# EAGLE design Granulobot_V10 (EAGLE 9.6.1)
DATE: 22-04-2019; REV: V1 P3; TITLE: TinyPICO
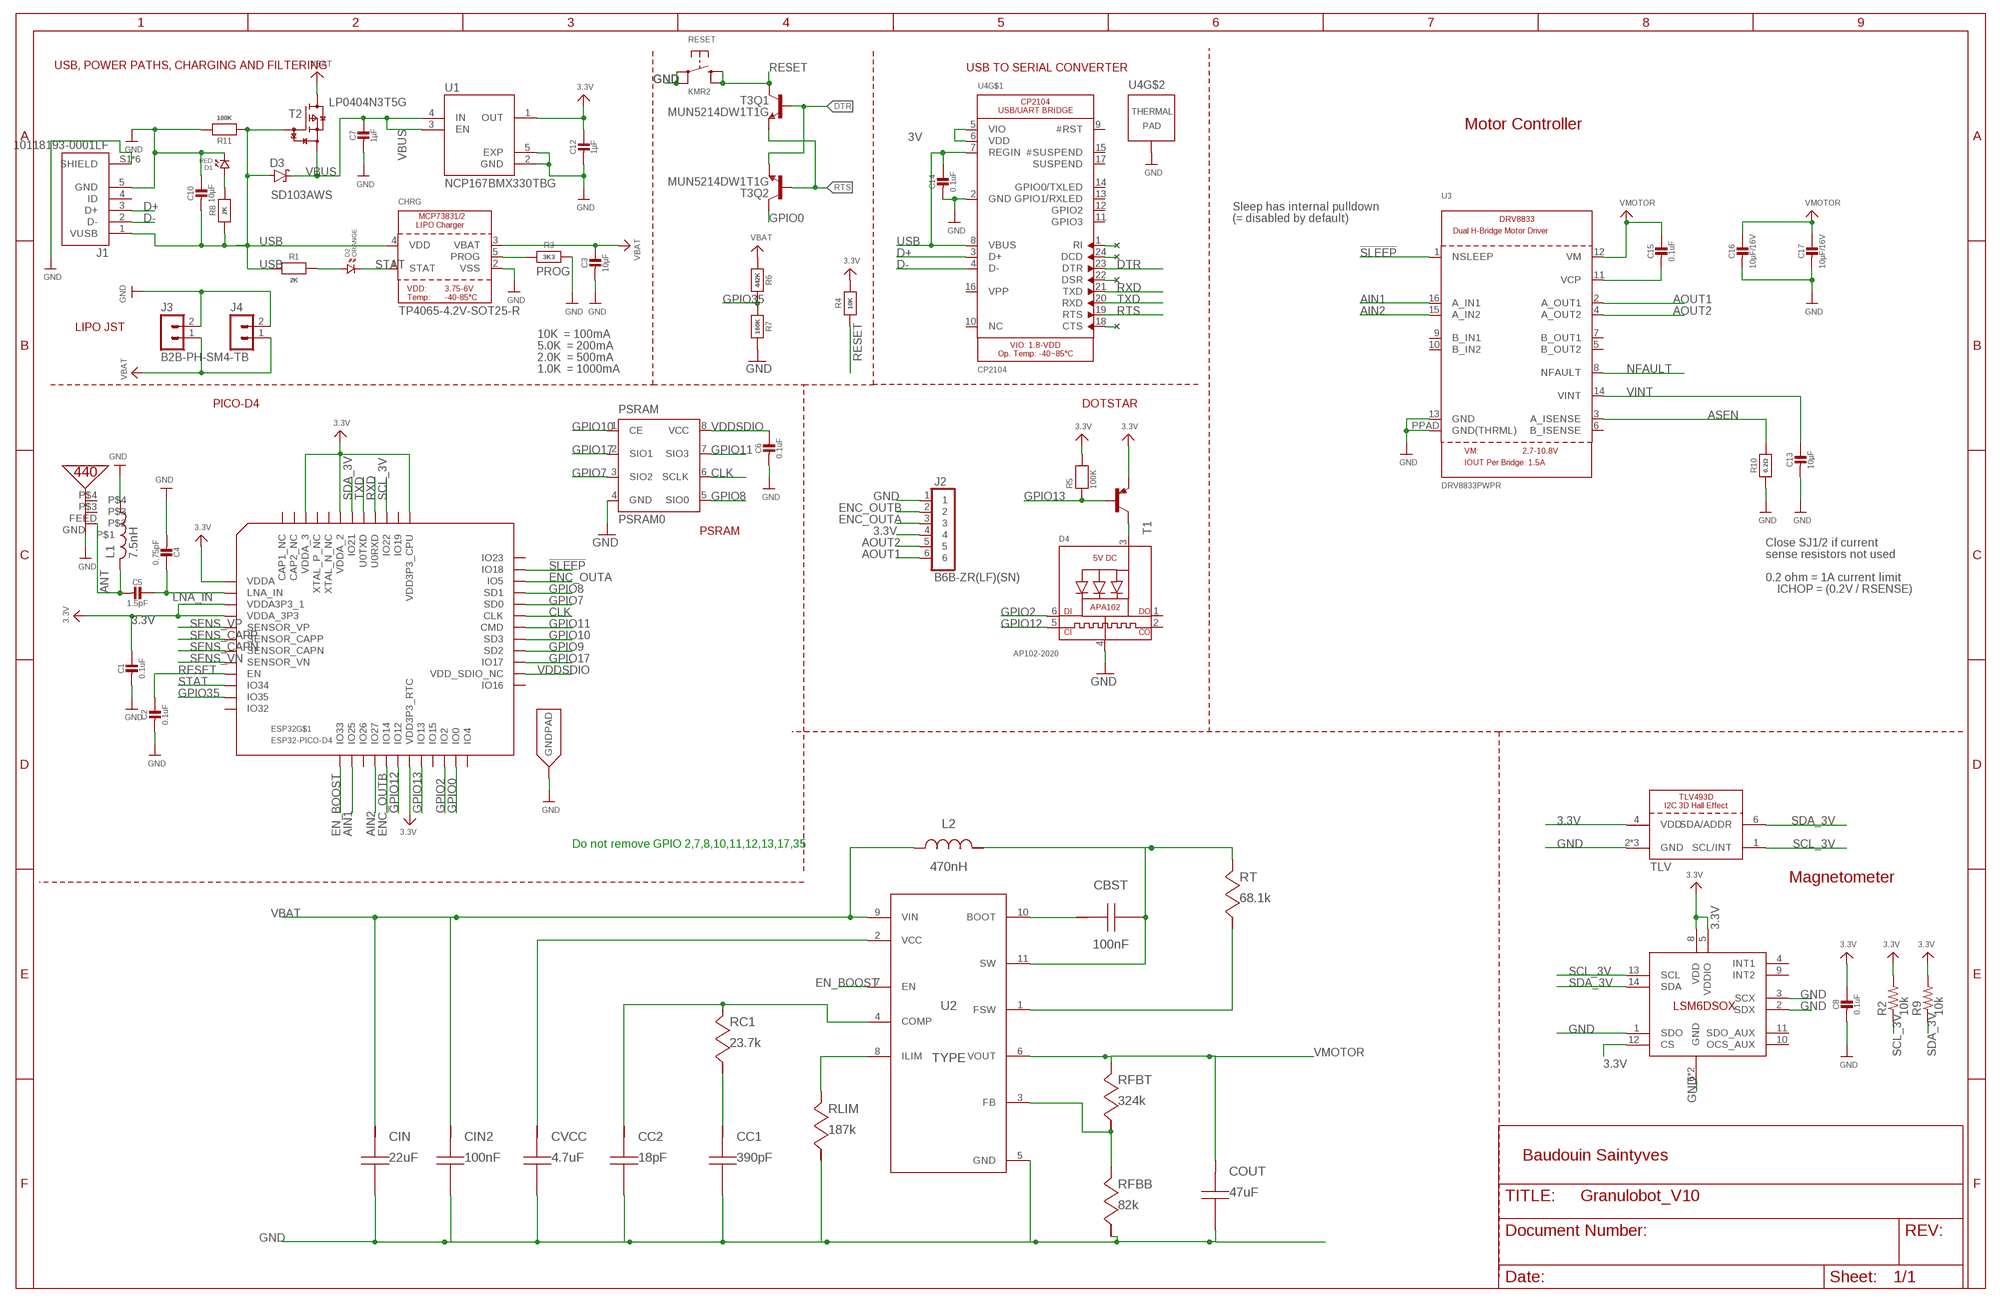
[diagram p0: schematic, sheet 1]

## Parts
ANT  PRO-OB-440  [PRO-OB-440]
C1  0.1uF  CAP_CERAMIC_0402MP  [_0402MP]
C2  0.1uF  CAP_CERAMIC_0402MP  [_0402MP]
C3  10µF  CAP_CERAMIC_0603MP  [_0603MP]
C4  0.75pF  CAP_CERAMIC_0402MP  [_0402MP]
C5  1.5pF  CAP_CERAMIC_0402MP  [_0402MP]
C6  0.1uF  CAP_CERAMIC_0402MP  [_0402MP]
C7  1µF  CAP_CERAMIC_0402MP  [_0402MP]
C8  0.1uF  CAP_CERAMIC0603_NO  [0603-NO]
C10  10µF  CAP_CERAMIC_0603MP  [_0603MP]
C12  1µF  CAP_CERAMIC_0402MP  [_0402MP]
C13  10µF  CAP_CERAMIC0805-NOOUTLINE  [0805-NO]
C14  0.1uF  CAP_CERAMIC_0402MP  [_0402MP]
C15  0.1uF  CAP_CERAMIC0805-NOOUTLINE  [0805-NO]
C16  10µF/16V  CAP_CERAMIC0805-NOOUTLINE  [0805-NO]
C17  10µF/16V  CAP_CERAMIC0805-NOOUTLINE  [0805-NO]
CBST  100nF  GRM155R71A104KA01D  [0402]
CC1  390pF  GRM1555C1H391JA01J  [0402]
CC2  18pF  C0402C0G1C180J020BC  [01005]
CHRG  TP4065-4.2V-SOT25-R  MCP73831/2  [SOT23-5]
CIN  22uF  GRM21BR61A226ME44L  [0805]
CIN2  100nF  GRM155R71C104KA88D  [0402]
COUT  47uF  C3216X5R1E476M160ACC3216X5R1E476M160AC  [1206]
CVCC  4.7uF  GRM155R61A475MEAAD  [0402_065]
D1  RED  LED.0402  [0402.LED]
D2  ORANGE  LED.0402  [0402.LED]
D3  BAT60J  [SOD323_ST]
D4  AP102-2020  MICROBUILDER_APA1022020  [MICROBUILDER_APA102_2020]
ESP32  ESP32-PICO-D4  [PICO-D4-QFN48]
J1  10118193-0001LF  [FCI_10118193-0001LF]
J2  B6B-ZR(LF)(SN)  [JST_B6B-ZR(LF)(SN)]
J3  B2B-PH-SM4-TB  [B2B-PH-SM4-TB]
J4  B2B-PH-SM4-TB  [B2B-PH-SM4-TB]
L1  7.5nH  INDUCTOR_0402_N  [RESC0402_N]
L2  470nH  IHLP1212AEERR47M11  [IHLP-1212AE]
LSM6  LSM6DSOX  [LGA-14L]
PSRAM  PSRAM0  [SOP8]
R1  2K  RESISTOR_0402MP  [_0402MP]
R2  10k  R-US_R0603  [R0603]
R3  3K3  RESISTOR_0402MP  [_0402MP]
R4  10K  RESISTOR_0402MP  [_0402MP]
R5  100K  RESISTOR_0402MP  [_0402MP]
R6  442K  RESISTOR_0402MP  [_0402MP]
R7  160K  RESISTOR_0402MP  [_0402MP]
R8  2K  RESISTOR_0402MP  [_0402MP]
R9  10k  R-US_R0603  [R0603]
R10  0.2Ω  RESISTOR_1206  [_1206]
R11  100K  RESISTOR_0402MP  [_0402MP]
RC1  23.7k  RC0201FR-0723K7L  [0201]
RESET  KMR2  SWITCH_TACT_SMT4.6X2.8  [BTN_KMR2_4.6X2.8]
RFBB  82k  RC0603FR-0782KL  [0603]
RFBT  324k  CRCW0402324KFKED  [0402]
RLIM  187k  CRCW0402187KFKED  [0402]
RT  68.1k  CRCW020168K1FKED  [0201]
T1  TINYPICO-PNPAMB  [SOT883(B)]
T2  TINYPICO-P-FETKMB  [SOT883(B)]
T3  MUN5214DW1T1G  MBT3904DW1T1  [DUAL_NPN_SC70-6]
TLV  TLV493D  [SOT23-6]
U1  NCP170AMX300TCG  [VREG_NCP170AMX300TCG]
U2  Value  TPS61089RNRR  [RNR0011A]
U3  DRV8833PWPR  DRV8833  [HTSSOP16]
U4  CP2104  MICROBUILDER_CP2104  [MICROBUILDER_QFN24_4MM_SMSC]

## Nets
3.3V: C1.1 C8.1 C12.1 ESP32.1(VDDA) ESP32.3(VDDA3P3_1) ESP32.4(VDDA_3P3) ESP32.19(VDD3P3_RTC) ESP32.37(VDD3P3_CPU) ESP32.43(VDDA_2) ESP32.46(VDDA_3) J2.4 LSM6.5(VDDIO) LSM6.8(VDD) LSM6.12(CS) R2.2 R4.2 R5.2 R9.2 T1.2(E) TLV.4(VDD) U1.1(OUT)
3V: U4.5(VIO) U4.6(VDD)
!SLEEP: ESP32.35(IO18) U3.1(NSLEEP)
AIN1: ESP32.14(IO25) U3.16(A_IN1)
AIN2: ESP32.16(IO27) U3.15(A_IN2)
ANT: ANT.FEED C5.2 L1.2
AOUT1: J2.6 U3.2(A_OUT1)
AOUT2: J2.5 U3.4(A_OUT2)
ASEN: R10.2 U3.3(A_ISENSE)
CLK: ESP32.31(CLK) PSRAM.6(SCLK)
D+: J1.3(D+) U4.3(D+)
D-: J1.2(D-) U4.4(D-)
DTR: T3.1(Q2:E) T3.5(Q1:B) U4.23(DTR)
EN_BOOST: ESP32.13(IO33) U2.7(EN)
ENC_OUTA: ESP32.34(IO5) J2.3
ENC_OUTB: ESP32.17(IO14) J2.2
GND: ANT.GND C1.2 C2.2 C3.2 C4.2 C6.2 C7.2 C8.2 C10.1 C12.2 C13.2 C14.2 C16.2 C17.2 CC1.2 CC2.2 CHRG.2(VSS) CIN2.2 CIN.2 COUT.2 CVCC.2 D1.P$2 D4.4(GND) ESP32.EXP(GNDPAD) J1.5(GND) J1.S1(SHIELD) J1.S2(SHIELD) J1.S3(SHIELD) J1.S4(SHIELD) J1.S5(SHIELD) J1.S6(SHIELD) J2.1 J3.2 J4.2 L1.1 LSM6.1(SDO) LSM6.2(SDX) LSM6.3(SCX) LSM6.6(GND) LSM6.7(GND) PSRAM.4(GND) R3.2 R7.2 R10.1 R11.2 RESET.A'(P1) RESET.A(P) RFBB.2 RLIM.2 TLV.2(GND) TLV.3(GND) TLV.5(GND) U1.2(GND) U1.5(EXP) U2.5(GND) U3.13(GND) U3.PPAD(GND(THRML)) U4.2(GND) U4.THERM(TP)
GPIO0: ESP32.23(IO0) T3.6(Q2:C)
GPIO2: D4.6(DI) ESP32.22(IO2)
GPIO7: ESP32.32(SD0) PSRAM.3(SIO2)
GPIO8: ESP32.33(SD1) PSRAM.5(SIO0)
GPIO9: ESP32.28(SD2)
GPIO10: ESP32.29(SD3) PSRAM.1(CE)
GPIO11: ESP32.30(CMD) PSRAM.7(SIO3)
GPIO12: D4.5(CKI) ESP32.18(IO12)
GPIO13: ESP32.20(IO13) R5.1 T1.1(B)
GPIO17: ESP32.27(IO17) PSRAM.2(SIO1)
GPIO35: ESP32.11(IO35) R6.2 R7.1
LNA_IN: C4.1 C5.1 ESP32.2(LNA_IN)
N$1: D1.P$1 R8.2
N$2: D2.P$1 R1.2
N$4: U4.1(RI)
N$5: U4.24(DCD)
N$6: U4.22(DSR)
N$7: U4.18(CTS)
N$8: D4.3(VDD) T1.3(C)
N$9: C15.2 U3.11(VCP)
N$10: RFBB.1 RFBT.2 U2.3(FB)
N$13: RLIM.1 U2.8(ILIM)
N$14: CBST.1 U2.10(BOOT)
N$15: CBST.2 L2.2 RT.1 U2.11(SW)
N$17: CVCC.1 U2.2(VCC)
N$18: CC1.1 RC1.2
N$19: CC2.1 RC1.1 U2.4(COMP)
N$20: RT.2 U2.1(FSW)
NFAULT: U3.8(NFAULT)
PROG: CHRG.5(PROG) R3.1
RESET: C2.1 ESP32.9(EN) R4.1 RESET.B'(S1) RESET.B(S) T3.3(Q1:C)
RTS: T3.2(Q2:B) T3.4(Q1:E) U4.19(RTS)
RXD: ESP32.40(U0RXD) U4.21(TXD)
SCL_3V: ESP32.39(IO22) LSM6.13(SCL) R2.1 TLV.1(SCL/INT)
SDA_3V: ESP32.42(IO21) LSM6.14(SDA) R9.1 TLV.6(SDA/ADDR)
SENS_CAPN: ESP32.7(SENSOR_CAPN)
SENS_CAPP: ESP32.6(SENSOR_CAPP)
SENS_VN: ESP32.8(SENSOR_VN)
SENS_VP: ESP32.5(SENSOR_VP)
STAT: CHRG.1(STAT) D2.P$2 ESP32.10(IO34)
TXD: ESP32.41(U0TXD) U4.20(RXD)
USB: C10.2 C14.1 CHRG.4(VDD) D3.A J1.1(VUSB) R1.1 R8.1 R11.1 T2.1(G) U4.7(REGIN) U4.8(VBUS)
VBAT: C3.1 CHRG.3(VBAT) CIN2.1 CIN.1 J3.1 J4.1 L2.1 R6.1 T2.3(D) U2.9(VIN)
VBUS: C7.1 D3.C T2.2(S) U1.3(EN) U1.4(IN)
VDDSDIO: C6.1 ESP32.26(VDD_SDIO_NC) PSRAM.8(VCC)
VINT: C13.1 U3.14(VINT)
VMOTOR: C15.1 C16.1 C17.1 COUT.1 RFBT.1 U2.6(VOUT) U3.12(VM)
Unconnected: ANT.P$3 ANT.P$4 D4.1(DO) D4.2(CKO) ESP32.12(IO32) ESP32.15(IO26) ESP32.21(IO15) ESP32.24(IO4) ESP32.25(IO16) ESP32.36(IO23) ESP32.38(IO19) ESP32.44(XTAL_N_NC) ESP32.45(XTAL_P_NC) ESP32.47(CAP2_NC) ESP32.48(CAP1_NC) J1.4(ID) LSM6.4(INT1) LSM6.9(INT2) LSM6.10(OCS_AUX) LSM6.11(SDO_AUX) U3.5(B_OUT2) U3.6(B_ISENSE) U3.7(B_OUT1) U3.9(B_IN1) U3.10(B_IN2) U4.9(#RST) U4.10(NC) U4.11(GPIO3) U4.12(GPIO2) U4.13(GPIO1/RXLED) U4.14(GPIO0/TXLED) U4.15(#SUSPEND) U4.16(VPP) U4.17(SUSPEND)

## Notes on the sheet
- USB, POWER PATHS, CHARGING AND FILTERING | USB TO SERIAL CONVERTER
- LP0404N3T5G
- Motor Controller
- NCP167BMX330TBG
- SD103AWS
- Sleep has internal pulldown
- (= disabled by default)
- LIPO JST
- 10K  = 100mA
- 5.0K  = 200mA
- 2.0K  = 500mA
- 1.0K  = 1000mA
- PICO-D4 | DOTSTAR
- PSRAM
- Close SJ1/2 if current
- sense resistors not used
- 0.2 ohm = 1A current limit
- ICHOP = (0.2V / RSENSE)
- Do not remove GPIO 2,7,8,10,11,12,13,17,35
- Magnetometer
- Baudouin Saintyves

## Library data of the parts
ANT = UnexpectedMaker:PRO-OB-440; OC_NEWARK: unknown
C1 C2 C6 C14 = microbuilder:CAP_CERAMIC: Ceramic Capacitors For new designs, use the packages preceded by an '_' character since they are more reliable: The following footprints should be used on most boards: _0402 - Standard footprint for regular board layouts _0603 - Standard footprint for regular board layouts _0805 - Standard footprint for regular board layouts _1206 - Standard footprint for regular board layouts For extremely tight-pitch boards where space is at a premium, the following 'micro-pitch' footprints can be used (smaller pads, no silkscreen outline, etc.): _0402MP - Micro-pitch footprint for very dense/compact boards _0603MP - Micro-pitch footprint for very dense/compact boards _0805MP - Micro-pitch footprint for very dense/compact boards _1206MP - Micro-pitch footprint for very dense/compact boards; MF: MULTICOMP PRO; MPN: MC0402X104K250CT; OC_NEWARK: 06X6159
C3 C10 = microbuilder:CAP_CERAMIC: Ceramic Capacitors For new designs, use the packages preceded by an '_' character since they are more reliable: The following footprints should be used on most boards: _0402 - Standard footprint for regular board layouts _0603 - Standard footprint for regular board layouts _0805 - Standard footprint for regular board layouts _1206 - Standard footprint for regular board layouts For extremely tight-pitch boards where space is at a premium, the following 'micro-pitch' footprints can be used (smaller pads, no silkscreen outline, etc.): _0402MP - Micro-pitch footprint for very dense/compact boards _0603MP - Micro-pitch footprint for very dense/compact boards _0805MP - Micro-pitch footprint for very dense/compact boards _1206MP - Micro-pitch footprint for very dense/compact boards; MF: SAMSUNG ELECTRO-MECHANICS; MPN: CL10A106KP8NNNC; OC_NEWARK: 82AC9284
C4 = microbuilder:CAP_CERAMIC: Ceramic Capacitors For new designs, use the packages preceded by an '_' character since they are more reliable: The following footprints should be used on most boards: _0402 - Standard footprint for regular board layouts _0603 - Standard footprint for regular board layouts _0805 - Standard footprint for regular board layouts _1206 - Standard footprint for regular board layouts For extremely tight-pitch boards where space is at a premium, the following 'micro-pitch' footprints can be used (smaller pads, no silkscreen outline, etc.): _0402MP - Micro-pitch footprint for very dense/compact boards _0603MP - Micro-pitch footprint for very dense/compact boards _0805MP - Micro-pitch footprint for very dense/compact boards _1206MP - Micro-pitch footprint for very dense/compact boards; MF: MURATA; MPN: GJM1555C1HR75BB01D; OC_NEWARK: 66AH5898
C5 = microbuilder:CAP_CERAMIC: Ceramic Capacitors For new designs, use the packages preceded by an '_' character since they are more reliable: The following footprints should be used on most boards: _0402 - Standard footprint for regular board layouts _0603 - Standard footprint for regular board layouts _0805 - Standard footprint for regular board layouts _1206 - Standard footprint for regular board layouts For extremely tight-pitch boards where space is at a premium, the following 'micro-pitch' footprints can be used (smaller pads, no silkscreen outline, etc.): _0402MP - Micro-pitch footprint for very dense/compact boards _0603MP - Micro-pitch footprint for very dense/compact boards _0805MP - Micro-pitch footprint for very dense/compact boards _1206MP - Micro-pitch footprint for very dense/compact boards; MF: TDK; MPN: C1005C0G1H1R5B050BA; OC_NEWARK: 90R7557
C7 C12 = microbuilder:CAP_CERAMIC: Ceramic Capacitors For new designs, use the packages preceded by an '_' character since they are more reliable: The following footprints should be used on most boards: _0402 - Standard footprint for regular board layouts _0603 - Standard footprint for regular board layouts _0805 - Standard footprint for regular board layouts _1206 - Standard footprint for regular board layouts For extremely tight-pitch boards where space is at a premium, the following 'micro-pitch' footprints can be used (smaller pads, no silkscreen outline, etc.): _0402MP - Micro-pitch footprint for very dense/compact boards _0603MP - Micro-pitch footprint for very dense/compact boards _0805MP - Micro-pitch footprint for very dense/compact boards _1206MP - Micro-pitch footprint for very dense/compact boards; MF: MURATA; MPN: GRT155R70J105KE01D.; OC_NEWARK: 01AC8891
C8 = microbuilder:CAP_CERAMIC: Ceramic Capacitors For new designs, use the packages preceded by an '_' character since they are more reliable: The following footprints should be used on most boards: _0402 - Standard footprint for regular board layouts _0603 - Standard footprint for regular board layouts _0805 - Standard footprint for regular board layouts _1206 - Standard footprint for regular board layouts For extremely tight-pitch boards where space is at a premium, the following 'micro-pitch' footprints can be used (smaller pads, no silkscreen outline, etc.): _0402MP - Micro-pitch footprint for very dense/compact boards _0603MP - Micro-pitch footprint for very dense/compact boards _0805MP - Micro-pitch footprint for very dense/compact boards _1206MP - Micro-pitch footprint for very dense/compact boards; MF: MULTICOMP PRO; MPN: MCSH18B104K250CT; OC_NEWARK: 23T7348
C13 = microbuilder:CAP_CERAMIC: Ceramic Capacitors For new designs, use the packages preceded by an '_' character since they are more reliable: The following footprints should be used on most boards: _0402 - Standard footprint for regular board layouts _0603 - Standard footprint for regular board layouts _0805 - Standard footprint for regular board layouts _1206 - Standard footprint for regular board layouts For extremely tight-pitch boards where space is at a premium, the following 'micro-pitch' footprints can be used (smaller pads, no silkscreen outline, etc.): _0402MP - Micro-pitch footprint for very dense/compact boards _0603MP - Micro-pitch footprint for very dense/compact boards _0805MP - Micro-pitch footprint for very dense/compact boards _1206MP - Micro-pitch footprint for very dense/compact boards; MF: TAIYO YUDEN; MPN: LMK212BJ106KG-T; OC_NEWARK: 18J2720
C15 = microbuilder:CAP_CERAMIC: Ceramic Capacitors For new designs, use the packages preceded by an '_' character since they are more reliable: The following footprints should be used on most boards: _0402 - Standard footprint for regular board layouts _0603 - Standard footprint for regular board layouts _0805 - Standard footprint for regular board layouts _1206 - Standard footprint for regular board layouts For extremely tight-pitch boards where space is at a premium, the following 'micro-pitch' footprints can be used (smaller pads, no silkscreen outline, etc.): _0402MP - Micro-pitch footprint for very dense/compact boards _0603MP - Micro-pitch footprint for very dense/compact boards _0805MP - Micro-pitch footprint for very dense/compact boards _1206MP - Micro-pitch footprint for very dense/compact boards; MF: MULTICOMP PRO; MPN: MCSH21B104K100CT; OC_NEWARK: 23T7403
C16 C17 = microbuilder:CAP_CERAMIC: Ceramic Capacitors For new designs, use the packages preceded by an '_' character since they are more reliable: The following footprints should be used on most boards: _0402 - Standard footprint for regular board layouts _0603 - Standard footprint for regular board layouts _0805 - Standard footprint for regular board layouts _1206 - Standard footprint for regular board layouts For extremely tight-pitch boards where space is at a premium, the following 'micro-pitch' footprints can be used (smaller pads, no silkscreen outline, etc.): _0402MP - Micro-pitch footprint for very dense/compact boards _0603MP - Micro-pitch footprint for very dense/compact boards _0805MP - Micro-pitch footprint for very dense/compact boards _1206MP - Micro-pitch footprint for very dense/compact boards; MF: YAGEO; MPN: CC0805KKX5R8BB106; OC_NEWARK: 69AH7309
CBST = accelerated_DesignTPS61089:GRM155R71A104KA01D; CAP: 1.0E7; ESR: 0.0; IRMS: 0.0; MANUFACTURER_NAME: MuRata; MANUFACTURER_PART_NUMBER: GRM155R71A104KA01D; MF: MULTICOMP PRO; MPN: MC0402X104K250CT; OC_NEWARK: 06X6159; VDC: 10.0; VENDOR: MuRata
CC1 = accelerated_DesignTPS61089:GRM1555C1H391JA01J; CAP: 3.9E10; DATASHEETURL: httpwww.murata.comproductscatalogpdfc02e.pdf; ESR: 0.0; IRMS: 0.0; MANUFACTURER_NAME: MuRata; MANUFACTURER_PART_NUMBER: GRM1555C1H391JA01J; MF: MULTICOMP PRO; MPN: MC0402B391K250CT; OC_NEWARK: 33R0285; VDC: 50.0; VENDOR: MuRata
CC2 = accelerated_DesignTPS61089:C0402C0G1C180J020BC; CAP: 1.8E11; DATASHEETURL: httpproduct.tdk.comcapacitormlccendocumentsmlcc%5Fcommercial%5Fgeneral%5Fen.pdf; ESR: 0.0; IRMS: 0.0; MANUFACTURER_NAME: TDK; MANUFACTURER_PART_NUMBER: C0402C0G1C180J020BC; MF: MURATA; MPN: GRM0225C1E180GA02L; OC_NEWARK: 66AH5990; VDC: 16.0; VENDOR: TDK
CHRG = microbuilder:MCP73831/2: MCP73831/2 LIPO Charger VDD: 3.75 - 6V Temp -40 - 85°C Programmable Charge Rate: 15-500mA NOTE: STAT is a tri-state logic output on the MCP73831 and an open-drain output on the MCP73832. SOT23-5 with 4.2V output and tri-state logic on STAT = MCP73831T-2ACI/OT; OC_NEWARK: unknown
CIN = accelerated_DesignTPS61089:GRM21BR61A226ME44L; CAP: 2.2E5; DATASHEETURL: httpssearch.murata.co.jpCeramyimageimgA01XG101ENGGRM21BR61A226ME44%2D01.pdf; ESR: 0.003; IRMS: 3.84; MANUFACTURER_NAME: MuRata; MANUFACTURER_PART_NUMBER: GRM21BR61A226ME44L; MF: KEMET; MPN: C1210C224J3GACTU; OC_NEWARK: 50AC8493; VDC: 10.0; VENDOR: MuRata
CIN2 = accelerated_DesignTPS61089:GRM155R71C104KA88D; CAP: 1.0E7; ESR: 0.0; IRMS: 0.0; MANUFACTURER_NAME: MuRata; MANUFACTURER_PART_NUMBER: GRM155R71C104KA88D; MF: MULTICOMP PRO; MPN: MC0402X104K250CT; OC_NEWARK: 06X6159; VDC: 16.0; VENDOR: MuRata
COUT = AcceleratedDesigns_Lib:C3216X5R1E476M160AC; CAP_F: 0.000047; MANUFACTURER_NAME: TDK; MANUFACTURER_PART_NUMBER: C3216X5R1E476M160AC; MF: KEMET; MOUNTTYPE: SMT; MPN: C0603C474K4PACTU; OC_NEWARK: 07X0824; ROHS: Y; VDC_V: 25
CVCC = accelerated_DesignTPS61089:GRM155R61A475MEAAD; CAP: 4.7E6; DATASHEETURL: httpsearch.murata.co.jpCeramyimageimgA01XG101ENGGRM155R61A475MEAA%2D01.pdf; ESR: 0.001; IRMS: 0.0; MANUFACTURER_NAME: MuRata; MANUFACTURER_PART_NUMBER: GRM155R61A475MEAAD; MF: TAIYO YUDEN; MPN: JMK105BBJ475MV-F; OC_NEWARK: 29T3551; VDC: 10.0; VENDOR: MuRata
D1 = cmonr_standardparts:LED; MF: WURTH ELEKTRONIK; MPN: 150040SS73220; OC_NEWARK: 95AC2581
D2 = cmonr_standardparts:LED; MF: DIALIGHT; MPN: 5988A30107F; OC_NEWARK: 07AH7391
D3 = diode:BAT60J: Schottky barrier diode Source: www.st.com, BAT60J.pdf; MF: STMICROELECTRONICS; MPN: BAT60JFILM; OC_NEWARK: 58M3986
D4 = UnexpectedMaker:MICROBUILDER_APA102: APA102/DotStar Pixels VCC: 5V DC Refresh Rate: 400Hz; OC_NEWARK: unknown
ESP32 = UnexpectedMaker:ESP32-PICO-D4; OC_NEWARK: unknown
J1 = microUSB_10118193-0001LF:10118193-0001LF: Micro USB B Type Receptacle; DESCRIPTION: USB - micro B USB 2.0 Receptacle Connector 5 Position Surface Mount, Right Angle; Through Hole; DIGI-KEY_PART_NUMBER: 609-4616-1-ND; MF: FCI; MP: 10118193-0001LF; PACKAGE: None; PURCHASE-URL: https://pricing.snapeda.com/search/part/10118193-0001LF/?ref=eda
J2 = B6B-ZR_LF__SN_:B6B-ZR(LF)(SN): ZR Series 1.5 mm Pitch 6 Position Through Hole Top Entry Shrouded Heade Check prices <https://pricing.snapeda.com/parts/B6B-ZR%28LF%29%28SN%29/JST%20Sales/view-part?ref=eda>; AVAILABILITY: Warning; DESCRIPTION: Connector Header Through Hole 6 position 0.059 (1.50mm); MF: JST Sales; MP: B6B-ZR(LF)(SN); PACKAGE: None; PRICE: None; PURCHASE-URL: https://pricing.snapeda.com/search/part/B6B-ZR(LF)(SN)/?ref=eda
J3 J4 = con-JST PH:B2B-PH: JST PH series header 2.00mm pitch disconnectable crimp style connectors, vertical (side entry type), 2 pins; MF: JST (JAPAN SOLDERLESS TERMINALS); MPN: B2B-PH-SM4-TB(LF)(SN); OC_NEWARK: 37K9941
L1 = Nordic_nRF:INDUCTOR: Generic chip inductor; MF: PANASONIC; MPN: ELJ-QF7N5JF; OC_NEWARK: 99W1858
L2 = accelerated_DesignTPS61089:IHLP1212AEERR47M11; DATASHEETURL: httpwww.vishay.comdocs34300lp12ae11.pdf; DCR: 15.0; DESCRIPTION: Unknown; IDC: 6.7; L: 4.7E7; MANUFACTURER: Vishay; MANUFACTURER_NAME: VishayDale; MANUFACTURER_PART_NUMBER: IHLP1212AEERR47M11; MF: VISHAY; MPN: IHLP1212AEERR47M11; OC_NEWARK: 27T2304; PACKAGE_DESIGNATOR: IHLP1212AE; VENDOR: VishayDale
LSM6 = microbuilder:LSM6DSOX; OC_NEWARK: unknown
PSRAM = UnexpectedMaker:PSRAM: H-bridge driver for brush motors Source: http://www.rohm.com/products/databook/motor/pdf/bd623x_series-e.pdf; MF: ROHM; MPN: BD6230F-E2; OC_FARNELL: 1716264; OC_NEWARK: 15R0529
R1 R8 = microbuilder:RESISTOR: Resistors For new designs, use the packages preceded by an '_' character since they are more reliable: The following footprints should be used on most boards: _0402 - Standard footprint for regular board layouts _0603 - Standard footprint for regular board layouts _0805 - Standard footprint for regular board layouts _1206 - Standard footprint for regular board layouts For extremely tight-pitch boards where space is at a premium, the following 'micro-pitch' footprints can be used (smaller pads, no silkscreen outline, etc.): _0402MP - Micro-pitch footprint for very dense/compact boards _0603MP - Micro-pitch footprint for very dense/compact boards _0805MP - Micro-pitch footprint for very dense/compact boards _1206MP - Micro-pitch footprint for very dense/compact boards; MF: PANASONIC; MPN: ERJ-2RKF2001X; OC_NEWARK: 73T6486
R2 R9 = adafruit:R-US_: RESISTOR, American symbol; MF: NIC COMPONENTS; MPN: NRC-AS06F1002TRF; OC_NEWARK: 52AH2942
R3 = microbuilder:RESISTOR: Resistors For new designs, use the packages preceded by an '_' character since they are more reliable: The following footprints should be used on most boards: _0402 - Standard footprint for regular board layouts _0603 - Standard footprint for regular board layouts _0805 - Standard footprint for regular board layouts _1206 - Standard footprint for regular board layouts For extremely tight-pitch boards where space is at a premium, the following 'micro-pitch' footprints can be used (smaller pads, no silkscreen outline, etc.): _0402MP - Micro-pitch footprint for very dense/compact boards _0603MP - Micro-pitch footprint for very dense/compact boards _0805MP - Micro-pitch footprint for very dense/compact boards _1206MP - Micro-pitch footprint for very dense/compact boards; MF: PANASONIC; MPN: ERJ-2RKF3301X; OC_NEWARK: 64R5278
R4 = microbuilder:RESISTOR: Resistors For new designs, use the packages preceded by an '_' character since they are more reliable: The following footprints should be used on most boards: _0402 - Standard footprint for regular board layouts _0603 - Standard footprint for regular board layouts _0805 - Standard footprint for regular board layouts _1206 - Standard footprint for regular board layouts For extremely tight-pitch boards where space is at a premium, the following 'micro-pitch' footprints can be used (smaller pads, no silkscreen outline, etc.): _0402MP - Micro-pitch footprint for very dense/compact boards _0603MP - Micro-pitch footprint for very dense/compact boards _0805MP - Micro-pitch footprint for very dense/compact boards _1206MP - Micro-pitch footprint for very dense/compact boards; MF: PANASONIC; MPN: ERJ-2RKF1002X; OC_NEWARK: 64R5248
R5 R11 = microbuilder:RESISTOR: Resistors For new designs, use the packages preceded by an '_' character since they are more reliable: The following footprints should be used on most boards: _0402 - Standard footprint for regular board layouts _0603 - Standard footprint for regular board layouts _0805 - Standard footprint for regular board layouts _1206 - Standard footprint for regular board layouts For extremely tight-pitch boards where space is at a premium, the following 'micro-pitch' footprints can be used (smaller pads, no silkscreen outline, etc.): _0402MP - Micro-pitch footprint for very dense/compact boards _0603MP - Micro-pitch footprint for very dense/compact boards _0805MP - Micro-pitch footprint for very dense/compact boards _1206MP - Micro-pitch footprint for very dense/compact boards; MF: MULTICOMP PRO; MPN: MCWR04X1003FTL; OC_NEWARK: 94X1105
R6 = microbuilder:RESISTOR: Resistors For new designs, use the packages preceded by an '_' character since they are more reliable: The following footprints should be used on most boards: _0402 - Standard footprint for regular board layouts _0603 - Standard footprint for regular board layouts _0805 - Standard footprint for regular board layouts _1206 - Standard footprint for regular board layouts For extremely tight-pitch boards where space is at a premium, the following 'micro-pitch' footprints can be used (smaller pads, no silkscreen outline, etc.): _0402MP - Micro-pitch footprint for very dense/compact boards _0603MP - Micro-pitch footprint for very dense/compact boards _0805MP - Micro-pitch footprint for very dense/compact boards _1206MP - Micro-pitch footprint for very dense/compact boards; MF: PANASONIC; MPN: ERJ-2RKF4423X; OC_NEWARK: 90W3049
R7 = microbuilder:RESISTOR: Resistors For new designs, use the packages preceded by an '_' character since they are more reliable: The following footprints should be used on most boards: _0402 - Standard footprint for regular board layouts _0603 - Standard footprint for regular board layouts _0805 - Standard footprint for regular board layouts _1206 - Standard footprint for regular board layouts For extremely tight-pitch boards where space is at a premium, the following 'micro-pitch' footprints can be used (smaller pads, no silkscreen outline, etc.): _0402MP - Micro-pitch footprint for very dense/compact boards _0603MP - Micro-pitch footprint for very dense/compact boards _0805MP - Micro-pitch footprint for very dense/compact boards _1206MP - Micro-pitch footprint for very dense/compact boards; MF: VISHAY; MPN: CRCW0402160KFKED; OC_NEWARK: 89M6611
R10 = microbuilder:RESISTOR: Resistors For new designs, use the packages preceded by an '_' character since they are more reliable: The following footprints should be used on most boards: _0402 - Standard footprint for regular board layouts _0603 - Standard footprint for regular board layouts _0805 - Standard footprint for regular board layouts _1206 - Standard footprint for regular board layouts For extremely tight-pitch boards where space is at a premium, the following 'micro-pitch' footprints can be used (smaller pads, no silkscreen outline, etc.): _0402MP - Micro-pitch footprint for very dense/compact boards _0603MP - Micro-pitch footprint for very dense/compact boards _0805MP - Micro-pitch footprint for very dense/compact boards _1206MP - Micro-pitch footprint for very dense/compact boards; MF: OHMITE; MPN: KDV12FR200ET; OC_NEWARK: 29AH2849
RC1 = accelerated_DesignTPS61089:RC0201FR-0723K7L; DATASHEETURL: httpwww.yageo.comdocumentsrecentPYu%2DRC%5FGroup%5F51%5FRoHS%5FL%5F5.pdf; MANUFACTURER_NAME: Yageo; MANUFACTURER_PART_NUMBER: RC0201FR0723K7L; OC_NEWARK: unknown; POWER: 0.05; RESISTANCE: 23700.0; TOLERANCE: 1.0; VENDOR: Yageo America
RESET = microbuilder:SWITCH_TACT_SMT: SMT Tact Switches 6x6mm - Digikey: P12940SCT-ND KMR2 (4.6x2.8mm) - Digikey: 401-1426-1-ND EVQ-PQHB55 - Light Touch, 160GF (4.5x4.5mm) - Digikey: P8090SCT-ND KMT0 - KMT021 NGJ LHS (etc.) IP68/Waterproof - Digikey: CKN10289CT-ND; MF: C & K COMPONENTS; MPN: KMR231G LFS; OC_NEWARK: 58M7853
RFBB = accelerated_DesignTPS61089:RC0603FR-0782KL; MANUFACTURER_NAME: Yageo; MANUFACTURER_PART_NUMBER: RC0603FR0782KL; MF: NIC COMPONENTS; MPN: NRC-AS06F8202TRF; OC_NEWARK: 52AH3034; POWER: 0.1; RESISTANCE: 82000.0; TOLERANCE: 1.0; VENDOR: Yageo America
RFBT = accelerated_DesignTPS61089:CRCW0402324KFKED; MANUFACTURER_NAME: VishayDale; MANUFACTURER_PART_NUMBER: CRCW0402324KFKED; MF: PANASONIC; MPN: ERJ-2RKF3243X; OC_NEWARK: 51W9080; POWER: 0.063; RESISTANCE: 324000.0; TOLERANCE: 1.0; VENDOR: VishayDale
RLIM = accelerated_DesignTPS61089:CRCW0402187KFKED; MANUFACTURER_NAME: VishayDale; MANUFACTURER_PART_NUMBER: CRCW0402187KFKED; MF: PANASONIC; MPN: ERJ-2RKF1873X; OC_NEWARK: 53W4257; POWER: 0.063; RESISTANCE: 187000.0; TOLERANCE: 1.0; VENDOR: VishayDale
RT = accelerated_DesignTPS61089:CRCW020168K1FKED; DATASHEETURL: httpwww.vishay.comdocs20052crcw0201e3.pdf; MANUFACTURER_NAME: VishayDale; MANUFACTURER_PART_NUMBER: CRCW020168K1FKED; MF: YAGEO; MPN: RC0201FR-0768K1L; OC_NEWARK: 82AH7827; POWER: 0.05; RESISTANCE: 68100.0; TOLERANCE: 1.0; VENDOR: VishayDale
T1 = UnexpectedMaker:TINYPICO-PNP: PNP general purpose transistors AAL Eindhoven MK; OC_NEWARK: unknown
T2 = UnexpectedMaker:TINYPICO-P-FET: 50 V, 150 mA P-channel Trench MOSFET P-channel enhancement mode Field-Effect Transistor (FET) in a small Surface-Mounted Device (SMD) plastic package using Trench MOSFET technology. AAL Eindhoven MK; OC_NEWARK: unknown
T3 = UnexpectedMaker:MBT3904DW1T1: MBT3904DW1 Dual NPN Transistors The MBT3904W1 puts two general purpose 3904 NPN transistors in a single package. Datasheet <http://www.onsemi.com/pub_link/Collateral/MBT3904DW1T1-D.PDF>; MF: ON SEMICONDUCTOR; MPN: MUN5214DW1T1G; OC_NEWARK: 10N9540; PROD_ID: TRANS-13337
TLV = microbuilder:TLV493D; MF: INFINEON; MPN: TLV493DA1B6HTSA2; OC_NEWARK: 18AC0661
U1 = NCP170AMX300TCG:NCP170AMX300TCG: Fixed LDO Voltage Regulator, 2.2V to 5.5V, 190mV Dropout, 3Vout, 150mAout, XDFN-4; AVAILABILITY: Unavailable; DESCRIPTION: Fixed LDO Voltage Regulator, 2.2V to 5.5V, 190mV Dropout, 3Vout, 150mAout, XDFN-4; MF: ON Semiconductor; MP: NCP170AMX300TCG; MPN: NCP170AMX300TCG; OC_NEWARK: 40Y8325; PACKAGE: XDFN-4 ON Semiconductor; PRICE: None
U2 = accelerated_DesignTPS61089:TPS61089RNRR; MANUFACTURER: Texas Instruments; MANUFACTURER_NAME: Texas Instruments; MANUFACTURER_PART_NUMBER: TPS61089RNRR; OC_NEWARK: unknown; PARTNUMBER: TPS61089RNRR; REFDES: RefDes; TYPE: TYPE
U3 = microbuilder:DRV8833: DRV8833 Dual H-Bridge Motor Driver -- HTSSOP Package; MF: TEXAS INSTRUMENTS; MPN: DRV8833PWPR; OC_NEWARK: 33AH3935
U4 = CP2104:MICROBUILDER_CP2104: CP2104 - USB to UART Bridge VDD Output: 3.45V; MF: SILICON LABS; MPN: CP2104-F03-GMR; OC_NEWARK: 74AC8649

## Board
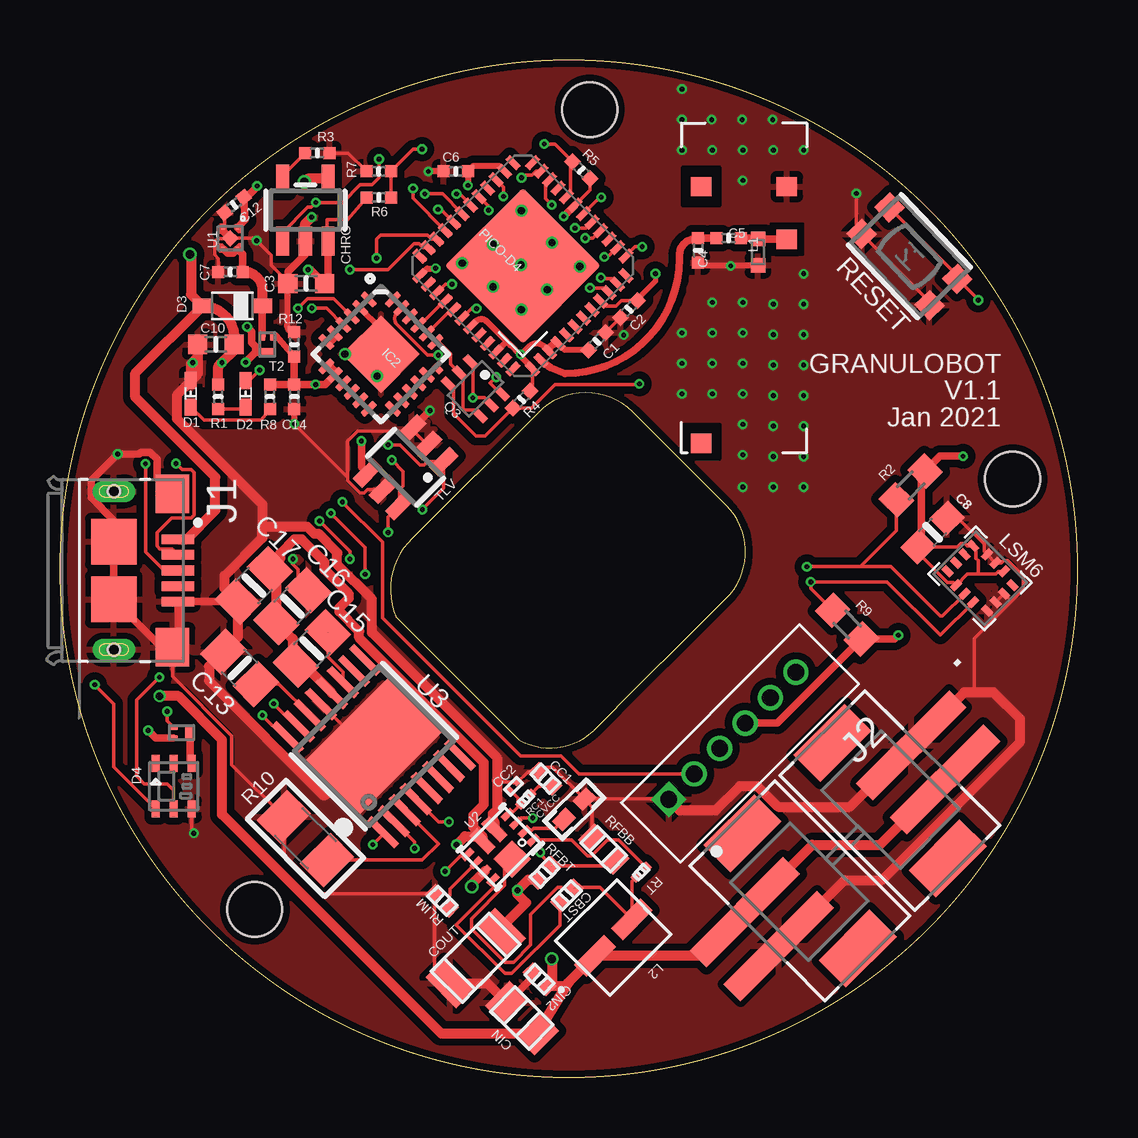
[diagram p1: board, top side]
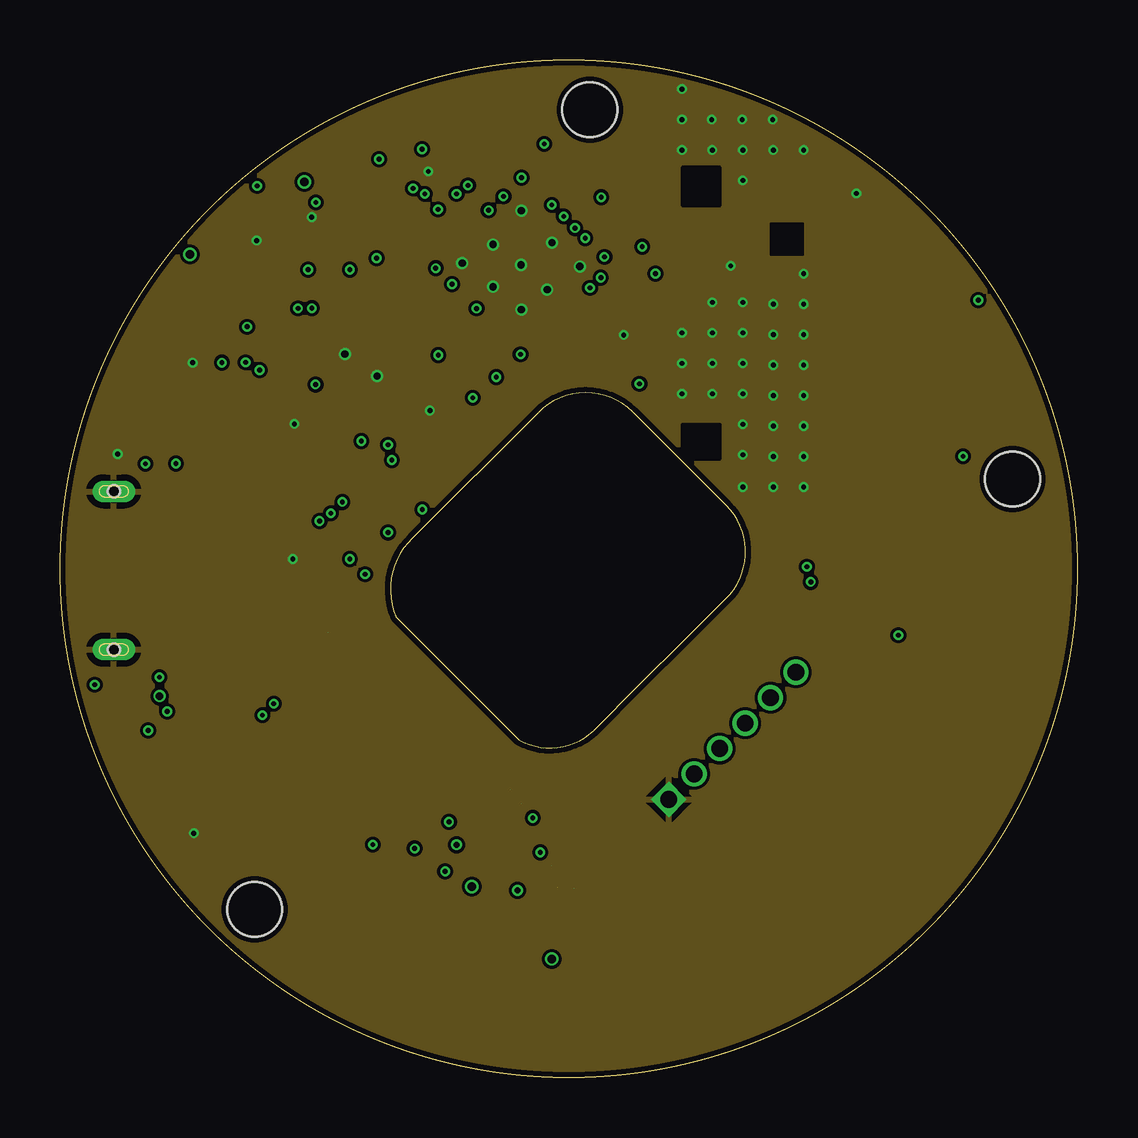
[diagram p2: board, inner layer GND]
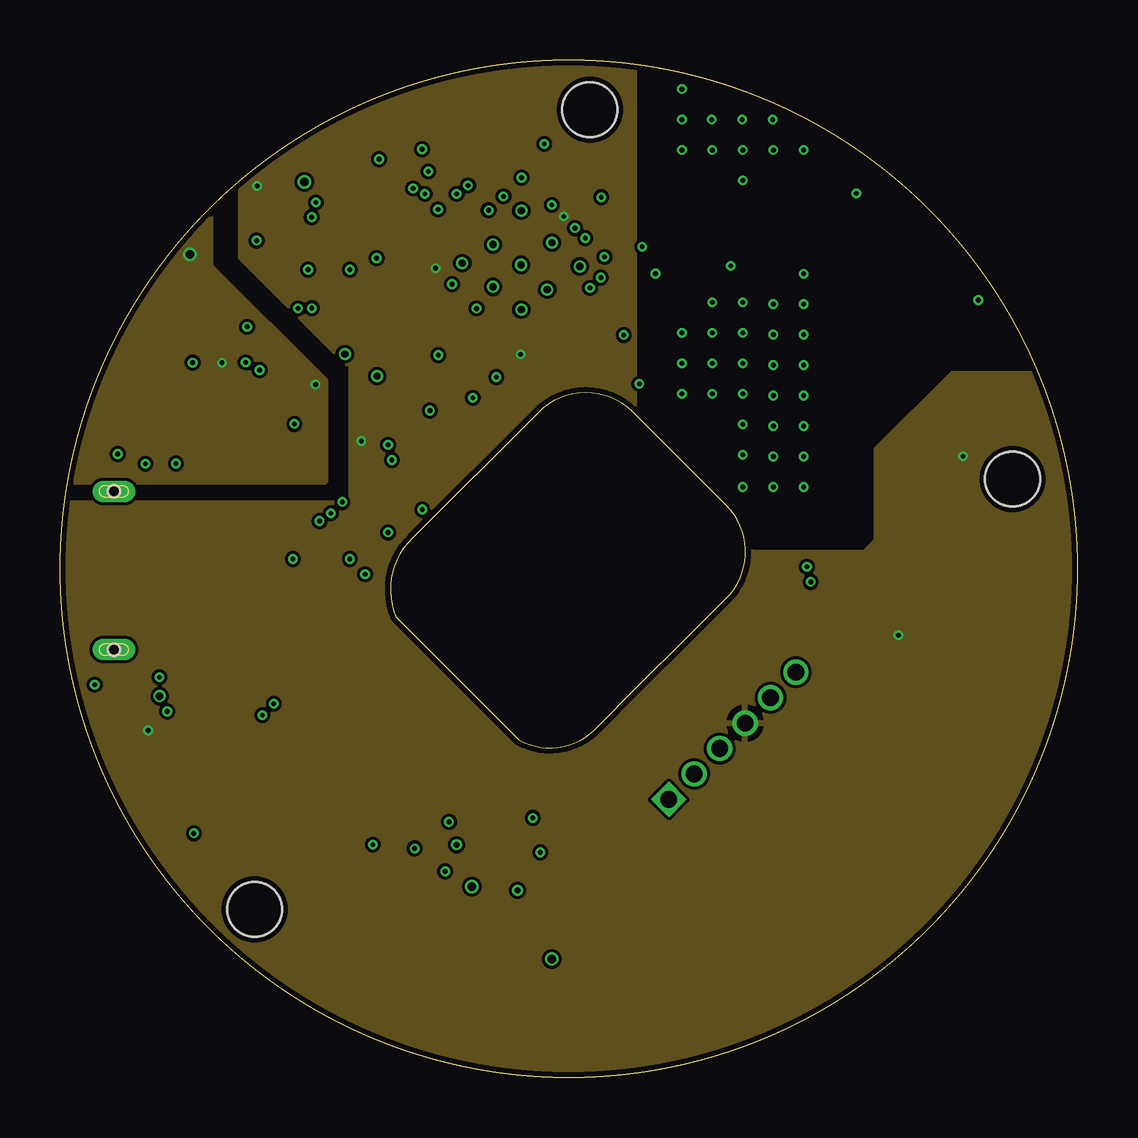
[diagram p3: board, inner layer 3.3V]
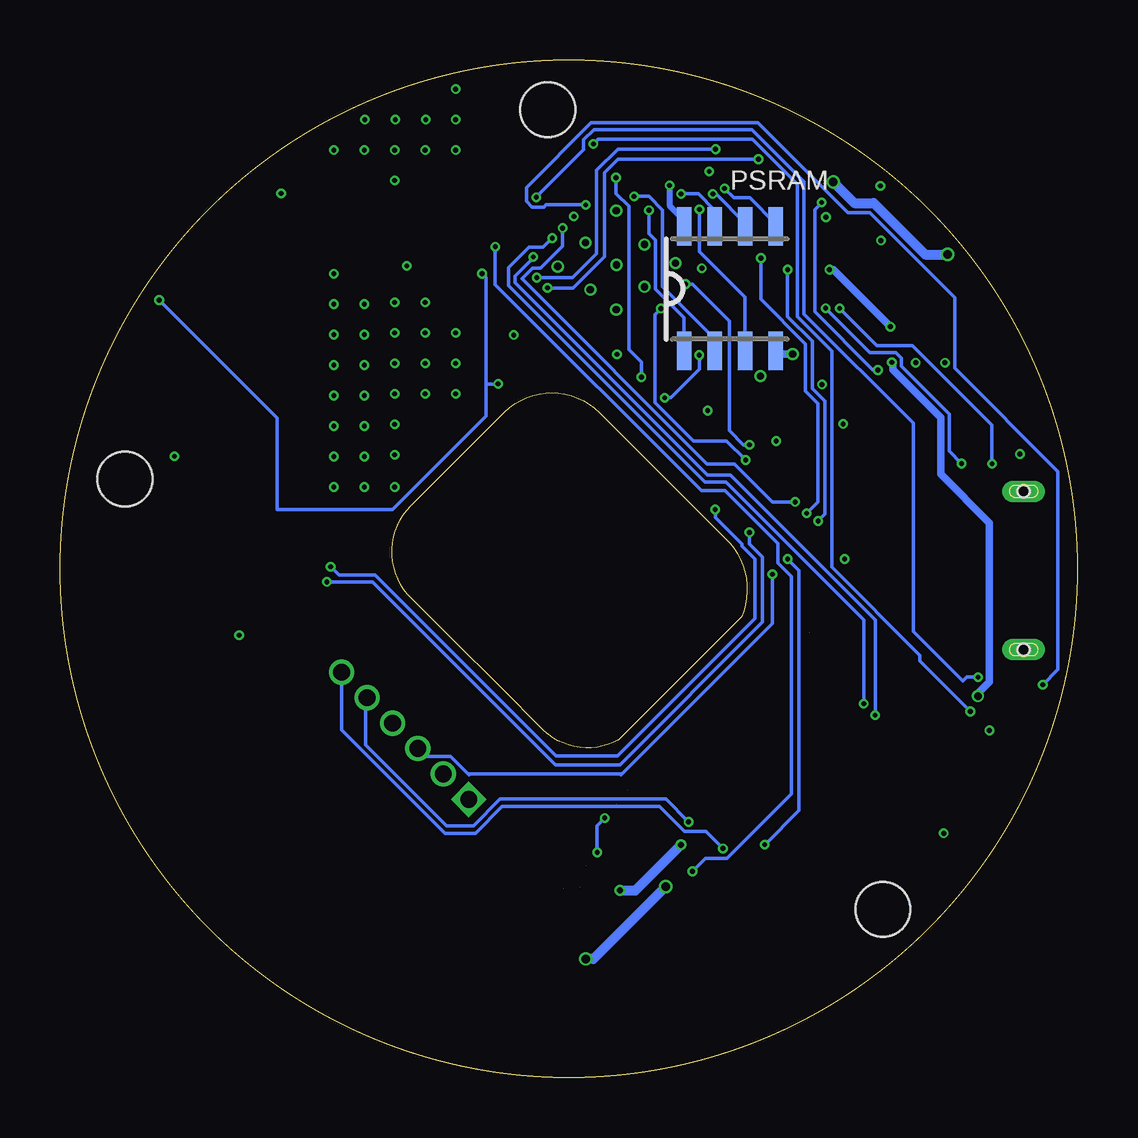
[diagram p4: board, bottom side, seen from below]

Size 42.42 x 42.42 mm. Coordinates in mm from the lower left corner, seen from the top.
Outline: 23.88,27.74 27.79,23.85 arc-84 27.93,20.14 arc0 22.24,14.46 arc-72 19.13,14.08 14.01,19.2 arc-70 14.69,22.48 19.94,27.73 arc-90 23.88,27.74
Outline: circle at 21.21,21.21 radius 21.21
Copper layers (1+2*15+16): Top 0.035mm / dielectric 0.18mm / GND 0.017mm / dielectric 1.12mm / 3.3V 0.017mm / dielectric 0.18mm / Bottom 0.035mm
Design rules "UnexpectedMaker_JLCPCB 4 Layer Tight": minimum track width 5mil, minimum drill 7mil, track to track 5mil, track to pad 5mil, pad to pad 5mil, via to via 5mil, smd to smd 5mil, copper to edge 9mil, drill to drill 6mil, minimum pad ring 4mil, minimum via ring 4mil, stop-mask expansion 1.25mil, vias tented up to drill 12mil, thermal gap 10mil
Holes 2.29 mm at 39.71,24.95 22.09,40.35 8.12,7.01

### Footprints (pad centres in the part's own frame; a part is rotated, then mirrored left to right if it is on the bottom)
PRO-OB-440 = smd 0.8 x 0.86: FEED 8.9,-4.4; GND 11.1,-4.4; P$3 11.1,-0.83; P$4 0.4,-0.83
_0402MP = smd 0.5 x 0.5: 1 -0.508,0; 2 0.508,0
_0603MP = smd 0.8 x 0.8: 1 -0.762,0; 2 0.762,0
0603-NO = smd 1.075 x 1: 1 -0.85,0; 2 0.85,0
0805-NO = smd 1.24 x 1.5: 1 -0.95,0; 2 0.95,0
0402 = smd 0.559 x 0.61: 1 -0.419,0; 2 0.419,0
01005 = smd 0.2 x 0.2: 1 -0.2,0; 2 0.2,0
SOT23-5 = smd 0.55 x 1.2: 1 -0.95,-1.3; 2 0,-1.3; 3 0.95,-1.3; 4 0.95,1.3; 5 -0.95,1.3
0805 = smd 1.118 x 1.448: 1 -0.902,0; 2 0.902,0
1206 = smd 1.118 x 1.803: 1 -1.499,0; 2 1.499,0
0402_065 = smd 0.8 x 0.6: 1 -0.6,0; 2 0.6,0
0402.LED = smd 0.7 x 0.5: P$1 -0.55,0; P$2 0.55,0
SOD323_ST = smd 0.8 x 0.6: A 1.25,0; C -1.25,0
MICROBUILDER_APA102_2020 = smd 0.7 x 0.35: 1 -0.95,-0.75; 2 -0.95,0; 3 -0.95,0.75; 4 0.95,0.75; 5 0.95,0; 6 0.95,-0.75
PICO-D4-QFN48 = smd 0.66 x 0.3: 1 -3.327,2.75; 2 -3.327,2.25; 3 -3.327,1.75; 4 -3.327,1.25; 5 -3.327,0.75; 6 -3.327,0.25; 7 -3.327,-0.25; 8 -3.327,-0.75; 9 -3.327,-1.25; 10 -3.327,-1.75; 11 -3.327,-2.25; 12 -3.327,-2.75; 25 3.327,-2.75; 26 3.327,-2.25; 27 3.327,-1.75; 28 3.327,-1.25; 29 3.327,-0.75; 30 3.327,-0.25; 31 3.327,0.25; 32 3.327,0.75; 33 3.327,1.25; 34 3.327,1.75; 35 3.327,2.25; 36 3.327,2.75 | smd 0.3 x 0.66: 13 -2.75,-3.327; 14 -2.25,-3.327; 15 -1.75,-3.327; 16 -1.25,-3.327; 17 -0.75,-3.327; 18 -0.25,-3.327; 19 0.25,-3.327; 20 0.75,-3.327; 21 1.25,-3.327; 22 1.75,-3.327; 23 2.25,-3.327; 24 2.75,-3.327; 37 2.75,3.327; 38 2.25,3.327; 39 1.75,3.327; 40 1.25,3.327; 41 0.75,3.327; 42 0.25,3.327; 43 -0.25,3.327; 44 -0.75,3.327; 45 -1.25,3.327; 46 -1.75,3.327; 47 -2.25,3.327; 48 -2.75,3.327 | smd 4.572 x 4.572: EXP 0,0
FCI_10118193-0001LF = smd 0.4 x 1.35: 1 -1.3,2.675; 2 -0.65,2.675; 3 0,2.675; 4 0.65,2.675; 5 1.3,2.675 | smd 1.6 x 1.4: S1 -3.2,2.45; S2 3.2,2.45 | smd 1.9 x 1.9: S3 1.2,0; S4 -1.2,0 | drill 0.5 pad 0.9 long: S5 -3.3,0; S6 3.3,0 | hole 0.5: -3.3,0; 3.3,0
JST_B6B-ZR(LF)(SN) = drill 0.7 square: 1 3.75,0 | drill 0.7: 2 2.25,0; 3 0.75,0; 4 -0.75,0; 5 -2.25,0; 6 -3.75,0
B2B-PH-SM4-TB = smd 1 x 5.5: 1 1,0; 2 -1,0 | smd 1.6 x 3: M1 3.4,-2.25; M2 -3.4,-2.25
RESC0402_N = smd 0.6 x 0.6: 1 -0.55,0; 2 0.55,0
IHLP-1212AE = smd 1.753 x 0.711: 1 -1.079,0; 2 1.079,0
LGA-14L = smd 0.475 x 0.25: 1 -1.163,0.75; 2 -1.163,0.25; 3 -1.163,-0.25; 4 -1.163,-0.75; 8 1.163,-0.75; 9 1.163,-0.25; 10 1.163,0.25; 11 1.163,0.75 | smd 0.25 x 0.475: 5 -0.5,-0.912; 6 0,-0.912; 7 0.5,-0.912; 12 0.5,0.912; 13 0,0.912; 14 -0.5,0.912
SOP8 = smd 0.6 x 1.6: 1 -1.905,-2.6; 2 -0.635,-2.6; 3 0.635,-2.6; 4 1.905,-2.6; 5 1.905,2.6; 6 0.635,2.6; 7 -0.635,2.6; 8 -1.905,2.6
R0603 = smd 1 x 1.1: 1 -0.85,0; 2 0.85,0
_1206 = smd 1.4 x 1.8: 1 -1.27,0; 2 1.27,0
0201 = smd 0.356 x 0.33: 1 -0.292,0; 2 0.292,0
BTN_KMR2_4.6X2.8 = smd 0.9 x 0.9: A 2.05,0.8; A' -2.05,0.8; B 2.05,-0.8; B' -2.05,-0.8
0603 = smd 0.66 x 0.965: 1 -0.699,0; 2 0.699,0
SOT883(B) = smd 0.4 x 0.25: 1 -0.35,0.225; 2 -0.35,-0.225 | smd 0.4 x 0.7: 3 0.35,0
DUAL_NPN_SC70-6 = smd 0.3 x 0.66: 1 -0.65,-0.92; 2 0,-0.92; 3 0.65,-0.92; 4 0.65,0.92; 5 0,0.92; 6 -0.65,0.92
SOT23-6 = smd 0.55 x 1.2: 1 -0.95,-1.3; 2 0,-1.3; 3 0.95,-1.3; 4 0.95,1.3; 5 0,1.3; 6 -0.95,1.3
VREG_NCP170AMX300TCG = smd 0.152 x 0.152: 1 -0.45,0.3; 2 -0.45,-0.3; 3 0.45,-0.3; 4 0.45,0.3 | smd 0.483 x 0.483 rotated 315: 5 0,0
RNR0011A = smd 0.55 x 0.25: 1 -1.175,0.75; 2 -1.175,0.25; 3 -1.175,-0.25; 4 -1.175,-0.75; 7 1.175,-0.75; 8 1.175,-0.25; 9 1.175,0.25; 10 1.175,0.75 | smd 0.45 x 1.1: 5 -0.35,-0.7; 6 0.35,-0.7 | smd 1.1 x 1.1: 11 0,0.7
HTSSOP16 = smd 0.3 x 1.6: 1 -2.275,-2.8; 2 -1.625,-2.8; 3 -0.975,-2.8; 4 -0.325,-2.8; 5 0.325,-2.8; 6 0.975,-2.8; 7 1.625,-2.8; 8 2.275,-2.8; 9 2.275,2.8; 10 1.625,2.8; 11 0.975,2.8; 12 0.325,2.8; 13 -0.325,2.8; 14 -0.975,2.8; 15 -1.625,2.8; 16 -2.275,2.8 | smd 4.8 x 3.2: PPAD 0,0
MICROBUILDER_QFN24_4MM_SMSC = smd 0.737 x 0.28: 1 -1.968,1.25; 2 -1.968,0.75; 3 -1.968,0.25; 4 -1.968,-0.25; 5 -1.968,-0.75; 6 -1.968,-1.25; 13 1.968,-1.25; 14 1.968,-0.75; 15 1.968,-0.25; 16 1.968,0.25; 17 1.968,0.75 | smd 0.28 x 0.737: 7 -1.25,-1.968; 8 -0.75,-1.968; 9 -0.25,-1.968; 10 0.25,-1.968; 11 0.75,-1.968; 12 1.25,-1.968; 19 1.25,1.968; 20 0.75,1.968; 21 0.25,1.968; 22 -0.25,1.968; 23 -0.75,1.968; 24 -1.25,1.968 | smd 0.457 x 0.28: 18 2.095,1.25 | smd 2.286 x 2.286: THERM 0,0

### Placement (x,y rotation side)
ANT  25.9,26.04 90 top
C1  22.38,30.69 45 top
C2  23.71,32.03 225 top
C3  10.26,33.1 180 top
C4  26.6,34.47 270 top
C5  27.87,34.99 0 top
C6  16.5,37.77 180 top
C7  7.1,33.58 180 top
C8  36.38,22.73 45 top
C10  6.5,30.56 0 top
C12  7.26,36.38 218.7 top
C13  7.49,17.08 135 top
C14  9.77,28.38 270 top
C15  10.5,17.89 45 top
C16  9.69,19.65 45 top
C17  8.09,20.52 225 top
CBST  21.13,7.6 45 top
CC1  20.24,12.45 135 top
CC2  18.9,12.13 45 top
CHRG  10.23,36.16 0 top
CIN  19.27,2.48 135 top
CIN2  19.99,4.1 135 top
COUT  17.33,4.99 225 top
CVCC  21.43,11.18 45 top
D1  5.45,28.5 90 top
D2  7.74,28.5 90 top
D3  7.19,32.16 180 top
D4  4.74,12.15 270 top
ESP32  19.29,33.84 135 top
J1  2.24,21.14 270 top
J2  28.03,14.25 225 top
J3  36.19,13.14 315 top
J4  29.26,6.19 135 top
L1  29.1,34.41 90 top
L2  23.07,5.84 45 top
LSM6  38.35,20.81 135 top
PSRAM  14.49,32.89 0 bottom
R1  6.59,28.38 270 top
R2  35.46,24.68 45 top
R3  10.72,38.54 0 top
R4  19.24,28.26 45 top
R5  21.73,37.83 315 top
R6  13.29,36.68 0 top
R7  13.29,37.77 180 top
R8  8.75,28.38 270 top
R9  32.81,18.88 315 top
R10  10.23,9.97 315 top
R11  9.77,30.56 90 top
RC1  19.42,11.61 45 top
RESET  35.41,34.23 133.6 top
RFBB  22.67,9.52 135 top
RFBT  20.2,8.54 45 top
RLIM  15.93,7.37 135 top
RT  24.22,8.56 45 top
T1  5.07,14.38 0 top
T2  8.65,30.56 270 top
T3  17.32,28.71 225 top
TLV  14.41,25.44 135 top
U1  7.1,34.98 270 top
U2  18.35,9.61 225 top
U3  13.09,13.82 45 top
U4  13.38,30.15 315 top

### Tracks (layer width: path | path; a pad name or v marks a point on that pad's centre or on a via)
3.3V  (via drill 0.2)
  Top 0.152: ESP32.19 22.09,36.99 R5.2 | R4.2 19.7,28.72 19.7,29.57 | LSM6.5 39.11,21.1 39,21 38.28,21 | 38.28,21 37.83,21 LSM6.12 37.23,20.64 37,20.64 35.77,21.87 C8.1 37.4,22.12 37.55,22.27 37.71,22.27 37.82,22.16 LSM6.8 38.19,22.04 38.19,21.65 38.28,21.55 38.28,21
  Top 0.254: ESP32.1 19.7,29.57 19.49,29.78 19.2,30.07 arc-90 v19.2,30.14 | v19.2,30.14 19.15,30.14 18.78,30.53 | 18.78,30.53 18.62,30.68 ESP32.46 | v19.2,30.14 19.23,30.14 19.55,30.47 arc-90 20.19,30.47 ESP32.3 | v21,35.89 | ESP32.43 17.13,31.31 17.35,31.53 arc-90 17.77,31.53 18.59,30.71 18.78,30.53 | C1.1 21.04,30.33 ESP32.4 | ESP32.37 15.01,33.43 15.3,33.73 v15.65,33.73 v15.66,33.74
  Top 0.305: ESP32.4 20.59,30.6 20.41,30.43 ESP32.3 | ESP32.19 v21,35.89 | U1.1 7.73,35.75 C12.1 7.73,36.65 8.22,37.14 v8.22,37.16 | T1.2 3.99,14.16 v3.67,14.47 | TLV.4 12.56,25.45 v12.56,26.54 | v34.95,18.44 34.79,18.28 R9.2 29.9,14.78 J2.4 | C8.1 35.91,22.25 35.91,25.12 R2.2 36.68,25.9 v37.65,25.9
  pour 3.3V: 7.48,43.36 23.99,43.36 23.99,26.85 28.91,21.93 33.52,21.93 33.99,22.41 33.99,26.22 37.17,29.39 43.04,29.39 43.04,-0.45 42.73,-0.77 -3.15,-0.77 -4.11,0.18 -4.11,24 11.93,24 12.09,24.15 12.09,29.71 11.93,29.71 7.48,34.16
3V
  Top 0.254: U4.6 11.3,30.66 11.45,30.81 U4.5
!SLEEP  (via drill 0.2)
  Top 0.152: ESP32.35 15.14,34.6 14.97,34.77 14.77,34.77 13.67,33.68 v12.09,33.68 | v12.09,21.61 12.09,21.93 v10.82,23.2 | U3.1 13.46,10.13 v13.04,9.71
  Bottom 0.152: v12.09,33.68 12.09,31.72 11.06,30.69 11.06,28.72 10.53,28.19 10.53,23.49 v10.82,23.2 | v12.09,21.61 11.61,21.14 11.61,11.14 v13.04,9.71
AIN1  (via drill 0.2)
  Top 0.152: ESP32.14 22.85,34.21 v22.69,34.21 | v8.44,15.1 9.35,14.19 U3.16
  Bottom 0.152: v22.69,34.21 22.69,34.16 23.44,33.41 23.44,33.13 15.42,25.11 14.47,25.11 8.44,19.07 v8.44,15.1
AIN2  (via drill 0.2)
  Top 0.152: ESP32.16 22.22,34.99 v21.9,34.99 | v8.91,15.58 9.85,14.65 U3.15
  Bottom 0.152: v21.9,34.99 22.28,34.62 22.86,34.62 23.72,33.75 23.72,33.01 15.54,24.83 14.67,24.83 8.91,19.07 v8.91,15.58
ANT
  Top 0.305: 28.39,34.98 C5.2 29.09,34.99 29.09,34.97 L1.2 30.28,34.96 ANT.FEED
  Top 0.406: 29.09,34.99 29.13,34.95
AOUT1  (via drill 0.2)
  Top 0.152: U3.2 14.79,9.82 v14.79,9.55
  Bottom 0.152: v14.79,9.55 15.49,10.26 16.38,10.26 17.42,11.29 23.99,11.29 25.1,10.18 26.37,10.18 30.68,14.49 J2.6 | J2.6
AOUT2  (via drill 0.2)
  Top 0.152: U3.4 15.78,10.66 v16.21,10.66
  Bottom 0.152: v16.21,10.66 17.17,11.61 24.07,11.61 25.18,10.5 26.3,10.5 29.67,13.87 29.67,15.79 J2.5
ASEN
  Top 0.152: R10.2 15.1,9.07 15.78,9.75 U3.3
CLK  (via drill 0.2)
  Top 0.152: ESP32.31 15.94,36.83 v15.21,36.83
  Bottom 0.152: PSRAM.6 13.86,35.62 15.08,36.83 v15.21,36.83
D+  (via drill 0.2)
  Top 0.152: v9.92,32.07 10.33,32.47 11.41,32.47 U4.3 | v3.57,25.58 3.57,21.91 4.34,21.14 J1.3
  Bottom 0.152: v9.92,32.07 8.36,30.5 6.88,30.5 3.57,27.19 v3.57,25.58
D-  (via drill 0.2)
  Top 0.152: v10.5,32.07 11.11,32.07 U4.4 | v4.84,25.6 5.09,25.34 5.48,25.34 5.6,25.22 5.6,23.45 5.48,23.33 4.65,23.33 4.04,22.72 4.04,22.15 4.16,22.03 4.67,22.03 J1.2
  Bottom 0.152: v10.5,32.07 8.66,30.22 7.58,30.22 7.34,29.99 7.34,29.65 5.35,27.66 5.35,26.11 v4.84,25.6
DTR  (via drill 0.2)
  Top 0.152: T3.5 17.69,28.34 v17.21,28.34 17.21,29.73 T3.1 | U4.23 14.06,31.9 arc90 14.06,31.38 15.32,30.12 v15.77,30.12
  Bottom 0.152: v15.77,30.12 15.77,29.52 16.95,28.34 v17.21,28.34
EN_BOOST  (via drill 0.2)
  Top 0.152: ESP32.13 23.98,34.63 v24.27,34.63 | v16.06,8.6 16.76,9.3 U2.7
  Bottom 0.152: v24.27,34.63 24.27,33.06 15.68,24.47 14.7,24.47 12.49,22.26 12.49,21.45 11.93,20.88 11.93,11.83 14.62,9.14 15.51,9.14 v16.06,8.6
ENC_OUTA  (via drill 0.2)
  Top 0.152: ESP32.34 15.5,34.95 15.33,35.12 13.37,35.12 13.2,34.95 v13.2,34.16 | v11.29,23.52 12.72,22.09 v12.72,20.98
  Bottom 0.152: v13.2,34.16 13.2,32.44 11.34,30.58 11.34,28.61 10.82,28.09 10.82,24 v11.29,23.52 | 19.03,12.62 19,12.65 | 19,12.65 12.72,18.93 v12.72,20.98 | J2.3 | J2.3 27.17,13.38 26.14,13.38 25.37,12.62 25.34,12.65 19,12.65
ENC_OUTB  (via drill 0.2)
  Top 0.152: v21.47,35.41 21.93,35.41 ESP32.17 | v11.77,24 13.45,22.32 13.45,19.16 19.19,13.42 20.88,13.42 21.64,12.65 J2.2
  Bottom 0.152: v21.47,35.41 21.47,34.66 22.38,33.75 22.71,33.75 23.16,33.3 15.45,25.58 14.31,25.58 12.72,24 v11.77,24
GND  (via drill 0.2, 0.3)
  Top 0.152: C2.2 22.74,31.06 C1.2 | CVCC.2 20.53,12.93 20.12,12.93 CC1.2 19.52,12.75 CC2.2 18.9,12.27 18.84,12.33 18.28,12.33 18.21,12.41 | COUT.2 15.61,4.59 15.61,7.14 15.63,7.16 RLIM.2 10.97,7.66 9.33,9.3 R10.1 7.17,13.03 7.17,14.25 4.69,16.72 J1.S2 | R3.2 12.02,38.54 R7.2 | U1.5 8.11,34.98 v8.19,34.89 8.8,34.29 8.8,33.86 9.5,33.16 C3.2 | C7.2 6.59,34.15 6.44,34.3 6.44,34.85 6.56,34.97 6.87,34.97 6.99,35.09 | v33.2,36.85 33.2,35.38 RESET.A 36.25,32.34 RESET.A' | 12,25.02 12,24.88 12.5,24.37 12.67,24.37 12.82,24.52 TLV.5 | 12,25.02 v9.77,27.25 | 12,25.02 12,26.54 12.4,26.94 14.57,26.94 TLV.3 | TLV.3 | TLV.3 TLV.2 | C8.2 37.43,23.33 38.52,22.23 38.52,21.93 LSM6.7 LSM6.6 39.24,21.46 39.35,21.56 39.52,21.56 40.17,20.91 40.17,20.36 39.69,19.88 | v9.71,21.61 9.71,21.41 9.93,21.18 9.93,20.75 C16.2 | C12.2 6.86,35.49 U1.2 | U3.13 12.63,13.82 U3.PPAD | D4.4 5.49,10.18 v5.58,10.18 | 39.69,19.88 38.98,19.17 | 38.98,19.17 38.12,18.31 38.12,16.06 | CVCC.2 22.17,11.29 RFBB.2 | CVCC.2 25.36,11.61 J2.1 | LSM6.1 38.94,19.17 38.98,19.17 | LSM6.2 LSM6.3 39.64,19.88 39.69,19.88
  Top 0.254: U4.2 13.38,31.22 U4.THERM | C14.2 v9.77,27.25 | R11.2 arc-90 9.47,31.37 9.47,33.06 C3.2 | C6.2 v15.36,37.77 | L1.1 29.08,33.84 v27.96,33.84 26.72,33.84 C4.2
  Top 0.305: C3.2 9.5,33.59 10.23,34.31 CHRG.2 | ESP32.EXP 18.41,34.73 v18.05,34.73 | U4.THERM 13.38,29.39 v13.22,29.24 | U1.2 6.8,35.28 6.99,35.09 U1.5 | TLV.3 v15.42,27.8 v15.42,27.81 | CIN.2 19.7,4.18 CIN2.2 | J1.S1 4.05,24.99 4.05,25.78 3.76,26.06 3.37,26.06 3.29,25.99 v2.4,25.99 1.3,24.88 1.3,24.18 2.24,23.23 J1.S4 J1.S3 4.24,17.94 J1.S2 4.92,18.16 J1.5 4.93,19.84 C17.2
  Top 0.406: CHRG.2 10.23,35.6 v10.49,35.87 | D1.P$2 5.45,29.74 5.48,29.77 5.74,30.03 C10.1 5.74,29.3 4.87,28.44 4.87,27.47 8.44,23.9 8.44,22.96 | R11.2 | 8.44,22.96 10.3,22.96 10.6,22.67 10.77,22.67 11.56,21.88 11.56,21.84 11.56,21.83 11.56,21.39 13,19.94 13,18.55 18.21,13.34 18.21,12.41 18.21,11.17 18.04,11 18.04,10.72 18.11,10.66 U2.5 | COUT.2 17.82,3.93 CIN.2 | J4.2 32.7,8.22 34.26,8.22 40.03,13.99 40.03,14.95 38.92,16.06 38.12,16.06 37.7,16.06 J3.2 32.92,11.28 29.93,11.28 29.07,12.14 28.33,12.14 27.33,11.14 25.83,11.14 J2.1 | 8.44,22.96 8.44,22.49 6.86,20.91 6.86,20.4 C17.2 7.42,18.35 C13.2 6.21,17.14 6.21,16.53 10.98,11.77 11.04,11.77 U3.PPAD
  Bottom 0.305: PSRAM.4 12.46,30.15 v11.88,30.15
  other vias: 19.23,36.14 21.67,33.81 19.23,32.01 16.77,33.95 20.51,34.8 20.31,32.85 18.05,32.96 19.22,33.88 5.53,29.8 28.46,24.62 29.73,24.62 25.92,38.66 31,33.51 28.46,38.66 28.46,32.31 28.46,31.04 31,30.97 28.46,29.77 28.46,37.39 28.46,27.23 28.46,28.5 25.92,39.93 25.92,41.2 31,24.62 31,27.16 31,28.43 31,29.7 31,32.24 28.44,39.93 31,38.66 25.92,28.5 25.92,29.77 31,25.89 28.46,25.96 27.19,38.66 27.17,39.93 29.73,38.66 29.71,39.93 29.73,30.97 29.73,27.16 29.73,28.43 29.73,29.7 29.73,32.24 29.73,25.89 27.19,32.31 27.19,31.04 27.19,29.77 27.19,28.5 23.5,30.95 25.92,31.04
  pour GND: -5.23,43.36 -5.23,-1.58 43.98,-1.58 43.98,43.36
  pour Top (isolate 0.305): -6.22,43.54 -6.22,-2.01 43.23,-2.01 43.23,43.54
  cutout GND: 29.65,35.6 29.65,34.31 30.97,34.31 30.97,35.6
  cutout GND: 25.94,37.94 25.94,36.35 27.52,36.35 27.52,37.94
GND2
  cutout GND: 25.94,27.22 25.94,25.79 27.52,25.79 27.52,27.22
GND4
  cutout Top: 25.94,37.94 25.94,36.35 27.52,36.35 27.52,37.94
GND6
  cutout Top: 25.94,27.22 25.94,25.79 27.52,25.79 27.52,27.22
GND8
  cutout Top: 29.65,35.6 29.65,34.31 30.97,34.31 30.97,35.6
GPIO0  (via drill 0.2)
  Top 0.152: T3.6 18.36,28.52 17.93,28.95 v18.18,29.2 | ESP32.23 19.85,37.78 19.68,37.61 19.34,37.61 v19.24,37.51
  Bottom 0.152: v19.24,37.51 19.24,36.85 18.71,36.32 18.71,30.35 18.18,29.82 v18.18,29.2
GPIO2  (via drill 0.2)
  Top 0.152: ESP32.22 20.31,37.33 20.31,37.32 20.24,37.25 20.24,36.64 v20.5,36.38 | v1.45,16.37 2.24,15.58 2.24,12.94 D4.6
  Bottom 0.152: v20.5,36.38 22.15,36.38 22.24,36.29 22.73,36.29 22.97,36.53 22.97,37.1 20.27,39.79 13.32,39.79 9.58,36.05 8.66,36.05 5.12,32.51 5.12,29.57 0.82,25.27 0.82,17.01 v1.45,16.37
GPIO7  (via drill 0.2)
  Top 0.152: ESP32.32 15.88,36.19 v15.76,36.19
  Bottom 0.152: v15.76,36.19 15.76,34.79 15.76,34.44 13.86,32.53 PSRAM.3
GPIO8  (via drill 0.2)
  Top 0.152: v14.72,37.06 14.72,36.65 ESP32.33
  Bottom 0.152: v14.72,37.06 14.33,36.68 13.67,36.68 12.59,35.6 PSRAM.5
GPIO10  (via drill 0.2)
  Top 0.152: ESP32.29 17.87,36.32 v17.87,36.15
  Bottom 0.152: PSRAM.1 16.4,31.67 17.6,32.87 17.6,34.91 17.87,35.19 v17.87,36.15
GPIO11  (via drill 0.2)
  Top 0.152: v16.53,36.84 16.65,36.84 ESP32.30
  Bottom 0.152: v16.53,36.84 15.8,36.84 15.13,36.17 PSRAM.7
GPIO12  (via drill 0.2)
  Top 0.152: ESP32.18 22.51,36.69 v22.56,36.69 | D4.5 4.74,11.97 4.47,12.25 3.51,12.25 3.2,12.57 3.2,15.74 v4.15,16.69
  Bottom 0.152: v22.56,36.69 20.59,38.67 20.59,39.09 20.16,39.51 13.56,39.51 11.4,37.35 11.4,31.83 6.85,27.28 6.85,18.59 4.79,16.53 4.63,16.69 v4.15,16.69
GPIO13  (via drill 0.2)
  Top 0.152: ESP32.20 21.29,36.89 21.29,38.1 R5.1 20.64,38.92 v20.18,38.92 | T1.1 4.47,14.86 v4.47,15.26
  Bottom 0.152: v4.47,15.26 6.57,17.37 6.57,17.6 10.25,21.28 10.25,30.28 11.68,31.71 11.68,37.24 13.55,39.11 19.99,39.11 v20.18,38.92
GPIO17  (via drill 0.2)
  Top 0.152: ESP32.27 18.49,37.12 v18.49,36.73
  Bottom 0.152: v18.49,36.73 17.88,36.73 17.3,36.16 17.3,32.96 15.13,30.8 PSRAM.2
GPIO35  (via drill 0.2)
  Top 0.152: v22.55,33.34 22.58,33.3 23.01,33.3 ESP32.11 | v15.09,38.7 14.72,38.7 R7.1 R6.2
  Bottom 0.152: v22.55,33.34 21.05,33.34 20.04,34.35 20.04,37.82 19.17,38.7 v15.09,38.7
LNA_IN
  Top 0.305: ESP32.2 20.08,29.89 20.21,29.76 20.45,29.59 21.04,29.34 arc90 25.82,34.12 25.82,34.29 arc-90 26.5,34.96 26.58,34.96 C4.1 26.61,34.99 C5.1
N$1
  Top 0.152: D1.P$1 6,27.4 8.39,27.4 R8.2
N$2
  Top 0.152: R1.2 7.65,27.87 D2.P$1
N$8
  Top 0.305: T1.3 5.42,13.17 D4.3
N$9  (1 unrouted)
  Top 0.152: U3.11 11.8,16.9 11.17,17.53 C15.2 11.38,18.35
N$10  (via drill 0.2)  (1 unrouted)
  Top 0.152: U2.3 19.21,10.82 v19.71,10.82 | RFBB.1 22.97,8.83 RFBT.2 20.02,9.31 v20.02,9.39
  Bottom 0.152: v19.71,10.82 20.02,10.5 v20.02,9.39
N$13
  Top 0.152: RLIM.1 16.23,7.57 16.25,7.6 16.25,7.86 U2.8
N$14
  Top 0.152: U2.10 18.05,7.91 16.52,6.38 18.56,4.34 18.82,4.34 20.84,6.35 CBST.1
N$15  (2 unrouted)
  Top 0.152: U2.11 18.54,8.8 18.54,8 17.15,6.61 17.15,6.21 18.55,4.81 18.9,4.81 19.62,5.53 19.62,6.81 20.73,7.92 20.9,7.92 20.93,7.89 CBST.2 | CBST.2 21.41,7.92 21.39,7.9 | RT.1 23.83,8.17 L2.2 22.51,7.92 21.45,7.92 CBST.2
N$17
  Top 0.152: U2.2 19.6,10.26 19.74,10.39 20.64,10.39 CVCC.1
N$18
  Top 0.152: CC1.1 20.03,12.16 20.01,12.13 19.95,12.13 RC1.2
N$19  (2 unrouted)
  Top 0.152: CC2.1 19.09,11.66 19.09,11.4 RC1.1 18.79,10.97 U2.4
N$20
  Top 0.152: RT.2 23.28,9.91 22.82,9.91 22.15,9.24 21.98,9.24 21.31,9.91 U2.1
PROG
  Top 0.152: CHRG.5 9.28,37.6 R3.1
RESET  (via drill 0.2)
  Top 0.152: ESP32.9 22.76,32.15 23.17,32.15 23.41,32.39 C2.1 | T3.3 16.4,28.71 16.4,27.68 17.34,26.74 17.72,26.74 R4.1 19.65,27.9 19.81,28.06 19.83,28.06 20.64,28.88 24.11,28.88 v24.15,28.92 | RESET.B' 37.57,33.13 | 37.57,33.13 v38.28,32.42 v38.28,32.41 | RESET.B 37.57,33.27 37.57,33.13
  Top 0.203: v24.83,33.51 24.83,33.2 24.07,32.44 C2.1
  Bottom 0.152: v24.83,33.51 24.67,33.35 24.67,28.92 | 24.67,28.92 24.67,27.56 28.55,23.68 33.36,23.68 33.36,27.49 v38.28,32.41 | v24.15,28.92 24.67,28.92
RTS
  Top 0.152: U4.19 15.8,30.66 16.28,30.18 16.28,29.75 T3.2 16.81,29.22 16.81,27.82 17.29,27.82 T3.4
RXD
  Top 0.152: ESP32.40 16.01,32.37 15.03,31.39 U4.21
SCL_3V  (via drill 0.2)
  Top 0.152: v16.35,33.07 16.07,33.07 15.72,32.72 ESP32.39 | v13.67,26.38 14.17,26.38 15.01,25.54 15.18,25.54 15.33,25.69 TLV.1 16,24.57 v15.1,23.68 | 33.36,21.3 v31.14,21.3 | LSM6.13 36.78,19.23 36.69,19.23 34.63,21.3 33.36,21.3 | R2.1 34.86,22.8 33.36,21.3
  Bottom 0.152: v16.35,33.07 16.06,33.07 14.52,31.54 14.52,26.97 13.92,26.38 v13.67,26.38 | v15.1,23.68 15.1,23.35 13.99,22.24 13.99,22.15 13.45,21.61 13.45,19.14 19.17,13.42 21.75,13.42 29.28,20.94 30.78,20.94 v31.14,21.3
SDA_3V  (via drill 0.2)
  Top 0.152: v17.36,32.06 arc90 17.16,32.06 ESP32.42 | v13.83,25.74 14.31,25.26 14.31,24.67 14.16,24.52 TLV.6 13.67,23.36 v13.67,22.72 | R9.1 31.3,20.39 v31.3,20.66 34.47,20.66 36.69,18.44 LSM6.14
  Bottom 0.152: v17.36,32.06 17.62,31.81 17.62,28.15 16.01,26.54 14.63,26.54 v13.83,25.74 | v13.67,22.72 13.67,22.25 13.13,21.7 13.13,18.99 19.07,13.04 21.77,13.04 29.39,20.66 v31.3,20.66
STAT  (via drill 0.2)
  Top 0.152: ESP32.10 22.69,32.92 v22.09,32.92 | D2.P$2 7.88,29.05 v8.32,29.49 | CHRG.1 9.28,35.23 10.33,36.28 10.46,36.28 v10.66,36.48 11.78,36.48 12.52,37.22 13.01,37.22 13.3,37.51 v13.3,38.28
  Bottom 0.152: v8.32,29.49 8.52,29.49 10.96,31.93 10.96,36.19 v10.66,36.48 | v22.09,32.92 21.03,32.92 19.73,34.22 19.73,37.72 19.17,38.28 v13.3,38.28
TXD
  Top 0.152: U4.20 15.33,31.04 16.31,32.02 ESP32.41
USB  (via drill 0.2, 0.35)
  Top 0.254: R11.1 9,30.94 T2.1 | U4.7 11.3,29.65 11.45,29.5 U4.8
  Top 0.305: R8.1 C14.1 | R11.1 C14.1 | U4.8 11.05,28.89 v10.65,28.89 v10.64,28.88 C14.1
  Top 0.406: D3.A arc-90 7.26,30.84 C10.2 7.26,30.31 v6.75,29.8 6.59,29.65 R1.1 | D3.A 3.14,29.36 3.14,28.36 6.48,25.02 6.48,23.64 5.28,22.44 J1.1 | v10.18,37.33 10.31,37.46 CHRG.4 | D3.A 5.47,32.64 5.47,34.27 v5.42,34.31
  Bottom 0.406: v10.18,37.33 9.31,36.46 8.49,36.46 6.35,34.31 v5.42,34.31
  pour 3.3V: -5.09,43.41 -5.09,24.85 11.07,24.85 11.07,29.02 6.28,33.81 6.28,43.41
VBAT  (via drill 0.2, 0.3, 0.35)
  Top 0.152: R6.1 12,35.77 11.13,35.77 11.13,34.9 CHRG.3
  Top 0.305: CHRG.3 11.18,33.29 C3.1 10.45,33.68 v10.34,33.68 | v7.74,29.82 8.16,30.24 | 8.16,30.24 T2.3 | v7.8,31.3 8,31.1 8,30.64 8.16,30.47 8.16,30.24
  Top 0.406: 21.22,3.99 L2.1 26.72,5.07 J4.1 31.36,9.71 34.17,9.71 J3.1 | 21.22,3.99 21.04,3.8 CIN2.1 20.5,4.02 v20.5,4.94 | 21.22,3.99 CIN.1 15.89,1.84 6.76,10.97 6.76,14.08 4.94,15.9 v4.15,15.9 | U2.9 17.17,8.07 v17.17,7.96
  Bottom 0.305: v10.34,33.68 10.18,33.68 v7.8,31.3 | v7.74,29.82 7.69,29.77 7.69,29.5 5.7,27.51 5.7,25.15 3.67,23.11 3.67,16.49 4.15,16.01 v4.15,15.9
  Bottom 0.406: v17.17,7.96 20.18,4.94 v20.5,4.94
VBUS
  Top 0.305: D3.C 8.43,32.15 T2.2 | C7.1 7.61,34.32 U1.4 7.39,34.53 7.22,34.36 6.99,34.36 6.82,34.53 U1.3
  Top 0.406: D3.C 8.44,32.88 arc90 C7.1
VDDSDIO  (via drill 0.2)
  Top 0.254: ESP32.26 18.31,38 17.24,38 C6.1 v17.01,37.19
  Bottom 0.254: PSRAM.8 16.4,35.74 17.01,36.35 v17.01,37.19
VINT
  Top 0.152: C13.1 9.12,16.41 U3.14
VMOTOR  (via drill 0.25)
  Top 0.406: C15.1 10.15,17.21 U3.12 | C15.1 9.83,17.84 9.71,17.96 9.71,18.29 C16.1 9.02,20.93 C17.1 9.17,21.6 9.17,21.83 9.77,22.43 10.08,22.43 11.02,21.49 11.02,21.17 12.04,20.15 12.04,19.98 11.65,19.59 11.65,19.43 12.47,18.6 12.47,18.33 17.68,13.12 17.68,11.39 17.23,10.94 17.23,10.44 17.61,10.06 | 17.61,10.06 U2.6 | COUT.1 18.39,6.25 19.43,7.29 19.07,7.64 v19.07,7.8 19.51,8.24 RFBT.1 | v16.53,9.71 16.88,10.06 17.61,10.06 | C15.1
  Bottom 0.406: v19.07,7.8 18.44,7.8 v16.53,9.71

### Text on the board
tNames: GRANULOBOT / V1.1 / Jan 2021